# Altium schematic sheet USB.SchDoc
size A4; SheetNumber: 3; SheetTotal: 4
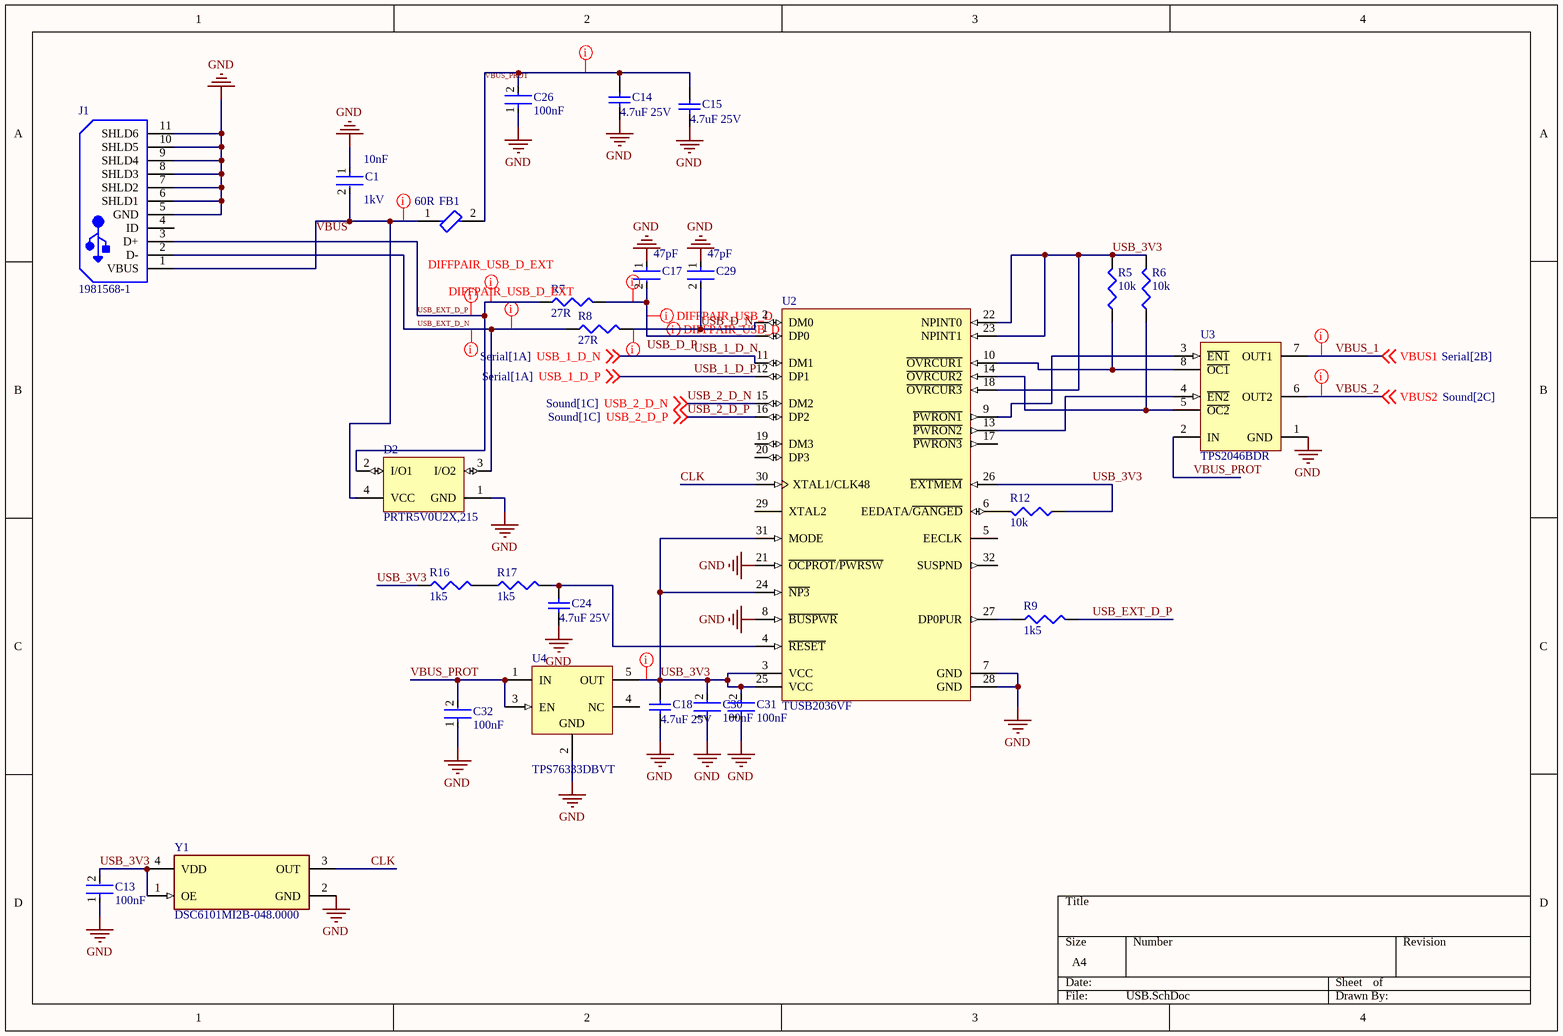
[diagram p0: USB.SchDoc]

## Parts
C1  Voltage Rating (DC): 1kV  Capacitance: 10nF  [FP-C4532-200-0_4-IPC_B]  (hidden comment: C4532X7R3A103K200KA)
C13  Capacitance: 100nF  [FP-CL10-IPC_B]  (hidden comment: CL10B104KC8NNNC)
C14  4.7uF 25V  [CAPC1210(3225)220_M]
C15  4.7uF 25V  [CAPC1210(3225)220_M]
C17  Capacitance: 47pF  [FP-CL10-IPC_C]  (hidden comment: CL10C470JC8NNNC)
C18  4.7uF 25V  [CAPC1210(3225)220_M]
C24  4.7uF 25V  [CAPC1210(3225)220_M]
C26  Capacitance: 100nF  [FP-CL10-IPC_B]  (hidden comment: CL10B104KC8NNNC)
C29  Capacitance: 47pF  [FP-CL10-IPC_C]  (hidden comment: CL10C470JC8NNNC)
C30  Capacitance: 100nF  [FP-CL10-IPC_B]  (hidden comment: CL10B104KC8NNNC)
C31  Capacitance: 100nF  [FP-CL10-IPC_B]  (hidden comment: CL10B104KC8NNNC)
C32  Capacitance: 100nF  [FP-CL10-IPC_B]  (hidden comment: CL10B104KC8NNNC)
D2  PRTR5V0U2X,215  [NXP-SOT143B-4_V]
FB1  Impedance: 60R  [FP-BLM41-0_2-IPC_B]  (hidden comment: BLM41PG600SN1L)
J1  1981568-1  [TECO-1981568-5_V]
R5  10k  [J1-0603]
R6  10k  [J1-0603]
R7  27R  [J1-0603]
R8  27R  [J1-0603]
R9  1k5  [J1-0603]
R12  10k  [J1-0603]
R16  1k5  [J1-0603]
R17  1k5  [J1-0603]
U2  TUSB2036VF  [VF0032A_N]
U3  TPS2046BDR  [D0008A_L]
U4  TPS76333DBVT  [DBV0005A_N]
Y1  DSC6101MI2B-048.0000  [FP-C04-C04-1200-0]

## Nets
GND: C1.1 C13.1 C14.1 C15.1 C17.1 C18.1 C24.1 C26.1 C29.1 C30.1 C31.1 C32.1 D2.1(GND) J1.5(GND) J1.6(SHLD1) J1.7(SHLD2) J1.8(SHLD3) J1.9(SHLD4) J1.10(SHLD5) J1.11(SHLD6) U2.7(GND) U2.8(~{BUSPWR}) U2.21(~{OCPROT}/~{PWRSW}) U2.28(GND) U3.1(GND) U4.2(GND) Y1.2(GND)
CLK: U2.30(XTAL1/CLK48) Y1.3(OUT)
USB_1_D_N: U2.11(DM1) ; off-sheet USB_1_D_N
USB_1_D_P: U2.12(DP1) ; off-sheet USB_1_D_P
USB_2_D_N: U2.15(DM2) ; off-sheet USB_2_D_N
USB_2_D_P: U2.16(DP2) ; off-sheet USB_2_D_P
USB_3V3: C13.2 C18.2 C30.2 C31.2 R5.2 R6.2 R12.1 R16.1 U2.3(VCC) U2.18(~{OVRCUR3}) U2.22(NPINT0) U2.23(NPINT1) U2.24(~{NP3}) U2.25(VCC) U2.26(~{EXTMEM}) U2.31(MODE) U4.5(OUT) Y1.1(OE) Y1.4(VDD)
USB_D_N: C29.2 R8.2 U2.2(DM0)
USB_D_P: C17.2 R7.2 U2.1(DP0)
USB_EXT_D_N: D2.3(I/O2) J1.2(D-) R8.1
USB_EXT_D_P: D2.2(I/O1) J1.3(D+) R7.1 R9.2
VBUS: C1.2 D2.4(VCC) FB1.1 J1.1(VBUS)
VBUS_1: U3.7(OUT1) ; off-sheet VBUS1  [also labelled VBUS1]
VBUS_2: U3.6(OUT2) ; off-sheet VBUS2  [also labelled VBUS2]
VBUS_PROT: C14.2 C15.2 C26.2 C32.2 FB1.2 U3.2(IN) U4.1(IN) U4.3(EN)
NetC24_2: C24.2 R17.2 U2.4(~{RESET})
NetR5_1: R5.1 U2.10(~{OVRCUR1}) U3.8(~{OC1})
NetR6_1: R6.1 U2.14(~{OVRCUR2}) U3.5(~{OC2})
NetR9_1: R9.1 U2.27(DP0PUR)
NetR12_2: R12.2 U2.6(EEDATA/~{GANGED})
NetR16_2: R16.2 R17.1
NetU2_9: U2.9(~{PWRON1}) U3.3(~{EN1})
NetU2_13: U2.13(~{PWRON2}) U3.4(~{EN2})

Not connected (* = marked no-connect by the designer): J1 4(ID); U2 5(EECLK) 17(~{PWRON3}) 19(DM3) 20(DP3) 29(XTAL2) 32(SUSPND); U4 4(NC)

## Layout directives
net class USB_Diff: USB_D_N, USB_D_P, USB_EXT_D_N, USB_EXT_D_P
net class USB_Pwr: USB_3V3, VBUS, VBUS_1, VBUS_2, VBUS_PROT
differential pair: USB_D_N, USB_D_P, USB_EXT_D_N, USB_EXT_D_P

## Library data of the parts
C1 = CMP-08246-006993-1: Multilayer Ceramic Capacitors 10nF ±10% 1000V X7R SMD 1812; Min Operating Temperature: -55°C; Number of Pins: 2; RoHS Compliant: Yes; Thickness: 0.087inch; Mount: Surface Mount; Voltage Rating: 1kV; Package Quantity: 1; Packaging: Tape and Reel; Width: 0.126inch; Lead Free: Lead Free; Dielectric: X7R; Weight: 0.000952oz; REACH SVHC: No SVHC; Case Code (Imperial): 1812; Max Operating Temperature: 125°C; Resistor Type: Ceramic; Case/Package: 1812; Depth: 3.2mm; Case Code (Metric): 4532; Tolerance: 10%; Series: C; Termination: SMD/SMT; Length: 4.5mm; JLCPCBPartNum: C577346
C13 C26 C30-C32 = CMP-13271-004036-1: Cap Ceramic 100nF 100V X7R ±10% Pad SMD 0603 +125°C T/R; Mount: Surface Mount; Packaging: Cut Tape; Width: 0.031inch; Thickness: 0.035inch; Length: 0.063inch; Tolerance: 10%; Min Operating Temperature: -55°C; Case/Package: 0603; Voltage Rating: 100V; Max Operating Temperature: 125°C; Case Code (Metric): 1608; Case Code (Imperial): 0603; JLCPCBPartNum: C15725
C14 C15 C18 C24 = CMP-1038-02151-2: CAP 4.7uF 25V ±10% 1210 (3225 Metric) Thickness 2.2mm SMD; Case-Metric: 3225; Case-EIA: 1210; Tolerance: Â±10%; Value: 4.7uF; Technology: SMT; Max Thickness: 2.2 mm; Rated Voltage: 25 V; JLCPCBPartNum: C86052
C17 C29 = CMP-13271-001416-1: Cap Ceramic 47pF 100V C0G ±5% Pad SMD 0603 +125°C T/R; Tolerance: 5%; Packaging: Tape and Reel; Thickness: 0.035inch; Dielectric: C0G; Max Operating Temperature: 125°C; Radiation Hardening: No; Width: 0.031inch; Height: 0.8mm; Voltage Rating: 100V; Case Code (Imperial): 0603; Voltage Rating (DC): 100V; Case/Package: 0603; Case Code (Metric): 1608; Min Operating Temperature: -55°C; Material: Ceramic; Length: 1.6mm; Mount: Surface Mount; Depth: 0.8mm; JLCPCBPartNum: C1671
D2 = CMP-2000-05285-1: Ultra Low Capacitance Double Rail-to-Rail ESD Protection Diode, 5.5 V, 1 pF, -40 to 85 degC, 4-Pin SOT143B, RoHS, Tape and Reel; Manufacturer: NXP Semiconductors; Capacitance Value: 16pF; Number of Elements: 1; Rad Hardened: No; Reverse Breakdown Voltage: 6V; Working Voltage (Max): 5.5V; Polarity: Uni-Directional; Configuration: Quad; Leakage Current: 0.1uA; Product Height (mm): 1mm; Suppressor Type: DiodeArrays; Product Length (mm): 3mm; Product Depth (mm): 1.4mm; ESD Protection Voltage: 8KV@ContactDisc; Package Type: SOT; Mounting: SurfaceMount; Packaging: TapeandReel; Datasheet Version: Rev. 02, 01/2008; Reverse Stand-off Voltage: 5.5V; Manufacturer URL: http://www.nxp.com/; Operating Temp Range: -40Cto85C; Operating Temperature Classification: Industrial; Working Voltage: 5.5V; Operating Temperature Min Deg. C: -40C; Datasheet URL: https://datasheet.ciiva.com/4479/prtr5v0u2x-102853-4479461.pdf; Leakage Current (Max): 0.1uA; Direction Type: Uni-Directional; Pin Count: 3+Tab; Operating Temperature Max Deg. C: 85C; Mounting Style: SurfaceMount; Package / Case: SOT; JLCPCBPartNum: C12333
FB1 = CMP-0686-00754-3: Ferrite Bead, 1806, 60Ω @ 100MHz, 0.009Ω, 6A; Manufacturer Series: BLM41P; Tolerance: 25%; Number of Lines: 1; Shielding: Unshielded; DC Resistance-Max: 9mR; Test Frequency: 100MHz; Case Code (Imperial): 1806; Height: 1.6mm; REACH SVHC: No SVHC; Radiation Hardening: No; Core Material: Ferrite; Case Code (Metric): 4516; Frequency: 100MHz; Number of Circuits: 1; Termination: SMD/SMT; Contact Plating: Tin; Width: 1.6mm; Number of Pins: 2; Package Quantity: 1; Series: BLM41P; Max DC Current: 6A; Inductor Type: FERRITE BEAD; Case/Package: 1806; DC Current: 6A; Number of Functions: 1; Length: 4.5mm; DC Resistance (DCR): 9mR; Terminal Finish: Tin; Military Standard: Not; Min Operating Temperature: -55°C; Depth: 1.6mm; Lead Free: Lead Free; Current: 6A; RoHS Compliant: Yes; Max Current Rating: 6A; Current Rating: 6A; Max Operating Temperature: 125°C; Packaging: Tape and Reel; Material: Ferrite; JLCPCBPartNum: C85844
J1 = CMP-2000-05408-1: Micro USB Receptacle Standard Type B Assy, 5-Pin SMD, RoHS, Tape and Reel; Manufacturer: TE Connectivity; Body Orientation: RightAngle; Number of Ports: 1Port; Number of Contacts: 5POS; Gender: RCP; Voltage Rating Max: 30VAC; Product Depth (mm): 5.6mm; Pitch (mm): 0.65mm; Current Rating (Max): 1/ContactA; Product Length (mm): 8mm; Product Height (mm): 3mm; Operating Temperature Max Deg. C: 85C; Datasheet URL: http://www.mouser.com/ds/2/418/NG_CD_1981568_E2-621296.pdf; Termination Method: Solder; Number of Terminals: 5; Operating Temp Range: -55Cto85C; Mounting Style: SurfaceMount; Manufacturer URL: http://www.te.com/; Contact Material: CopperAlloy; Packaging: TapeandReel; Datasheet Version: Rev. E2, 08/2015; Operating Temperature Min Deg. C: -55C; Housing Material: Thermoplastic; Type: MicroUSB; Contact Plating: GoldOverNickel; JLCPCBPartNum: C428487
R5-R9 R12 R16 R17 = Res3: Resistor; Published: 8-Jun-2000; LatestRevisionDate: 29-May-2009; LatestRevisionNote: IPC-7351 Footprint Added.; PackageReference: J1-0603; Publisher: Altium Limited; PackageDescription: Chip Resistor
  R5 R6 R12: Value: 10k; JLCPCBPartNum: C25804
  R7 R8: Value: 27R; JLCPCBPartNum: C192531
  R9 R16 R17: Value: 1k5; JLCPCBPartNum: C192164
U2 = CMP-0309-00077-2: 2 / 3-Port Hub for USB with Optional Serial EEPROM Interface, 3.3V, 0 to 70 degC, 32-Pin LQFP (VF), Green (RoHS & no Sb/Br); Manufacturer: Texas Instruments; USB Speed: Full; Supply Voltage(s)(V): 3.3; SubFamily: USB Hub Controller; USB Full Speed: True; ComponentLink2Description: Package Specification; Eco-Plan: Green (RoHS & no Sb/Br); ComponentLink1Description: Datasheet; ComponentLink2URL: http://www.ti.com/litv/pdf/mtqf002b; PackageVersion: revD, Apr-2000; PartNumber: TUSB2036VF; PackageReference: VF0032A; ComponentLink1URL: http://www.ti.com/general/docs/lit/getliterature.tsp?genericPartNumber=TUSB2036&fileType=pdf; Mounting Technology: Surface Mount; Integrated MCU Architecture: N/A; PackageDescription: 32-Pin Plastic Quad Flatpack, 7 x 7 mm Body, 0.8 mm Pitch; DatasheetVersion: SLLS372E; JLCPCBPartNum: C43665
U3 = CMP-0337-00031-2: Current-Limited Power-Distribution Switch, 0.5 A Current Limit, -40 to 85 degC, 8-pin SOIC (D), Green (RoHS & no Sb/Br); Manufacturer: Texas Instruments; Continuous Current(Max)(A): 0.25; UL Listed: TRUE; Vin(Min)(V): 2.7; Rating: Catalog; Current Limit(A): 0.5; rDS(on) per FET(Typ)(mOhms): 70; Number of Switches: 2; Vin(Max)(V): 5.5; Enable: Active Low; ComponentLink1Description: Datasheet; Code_JEDEC: MS-012AA; PackageDescription: 8-Pin Plastic Small Outline Integrated Circuit, 4.9 x 3.9 mm, Pitch 1.27 mm Pitch; PackageReference: D0008A; DatasheetVersion: SLVS532C; NEMKO: TRUE; Mounting Technology: Surface Mount; ComponentLink1URL: http://www.ti.com/general/docs/lit/getliterature.tsp?genericPartNumber=TPS2046B&fileType=pdf; PackageVersion: revM, Jun-2011; PartNumber: TPS2046BDR; Eco-Plan: Green (RoHS & no Sb/Br)
U4 = CMP-0394-00563-2: Single Output LDO, 150 mA, Fixed 3.3 V Output, 2.7 to 10 V Input, with Low IQ, 5-pin SOT-23 (DBV), -40 to 125 degC, Green (RoHS & no Sb/Br); Manufacturer: Texas Instruments; Vin(Max)(V): 10; Iq(Typ)(mA): 0.08; Accuracy(%): 3; Vout Adj(Max)(V): 3.3; Iout(Max)(A): 0.15; Vin(Min)(V): 2.7; Vdo(Typ)(mV): 300; SubFamily: Single Channel LDO; ComponentLink2URL: http://www.ti.com/general/docs/lit/getliterature.tsp?genericPartNumber=TPS76333&fileType=pdf; ComponentLink2Description: Datasheet; Code_JEDEC: MO-178; PartNumber: TPS76333DBVT; Vout Adj(Min)(V): 3.3; PackageDescription: 5-Pin Plastic Small Outline, Body 1.60 Ãƒâ€” 2.90 mm, Pitch 0.95 mm; Eco-Plan: Green (RoHS & no Sb/Br); PackageReference: DBV0005A; Mounting Technology: Surface Mount; ComponentLink3Description: Package Specification; DatasheetVersion: SLVS181H; ComponentLink3URL: http://www.ti.com/litv/pdf/mpds018i; PackageVersion: 4073253-4/K; Fixed Output Options(V): 3.3; ComponentLink1URL: http://www.ti.com/; ComponentLink1Description: Manufacturer URL; JLCPCBPartNum: C7100
Y1 = CMP-06255-000002-1: MEMS OSC XO 48.0000MHZ CMOS SMD; Manufacturer Part Number: DSC6101MI2A-024.0000T; Manufacturer: Microchip; Max Supply Voltage: 3.63V; Standoff Height: 0mm; Stability: 25ppm; Frequency: 24MHz; Max Junction Temp: +150°C; Min Supply Voltage: 1.71V; Ambient Temperature Range High: +85°C; Series: DSC61; Device Class L3: Oscillators; Package: C04-C04-1200; ComponentLink2URL: http://ww1.microchip.com/downloads/en/DeviceDoc/20005624B.pdf; Automotive: No; Ambient Temperature Range Low: -40°C; Category: Crys; ComponentLink2Description: Datasheet; Device Class L1: Passive Components; Temperature Range High: +150°C; Digikey Description: MEMS OSC XO 24.0000MHZ CMOS SMD; Mouser Description: Ultra-Low Power, Mems Oscillator, 2016, -40 To 85, 25Ppm4 Vflga 2.0X1.6X0.89Mm T/R; Height: 0.89mm; Octopart: https://octopart.com/dsc6101mi2a-024.0000t-microchip-75516980; Footprint Url: http://ww1.microchip.com/downloads/en/DeviceDoc/04L_VFLGA_2-0x1-6x0-89_ASA_C04-01200b.pdf; Temperature: to +150°C; Device Class L2: Crystals / Oscillators; RoHS: TRUE; Lead Free: Yes; JLCPCBPartNum: C1671481